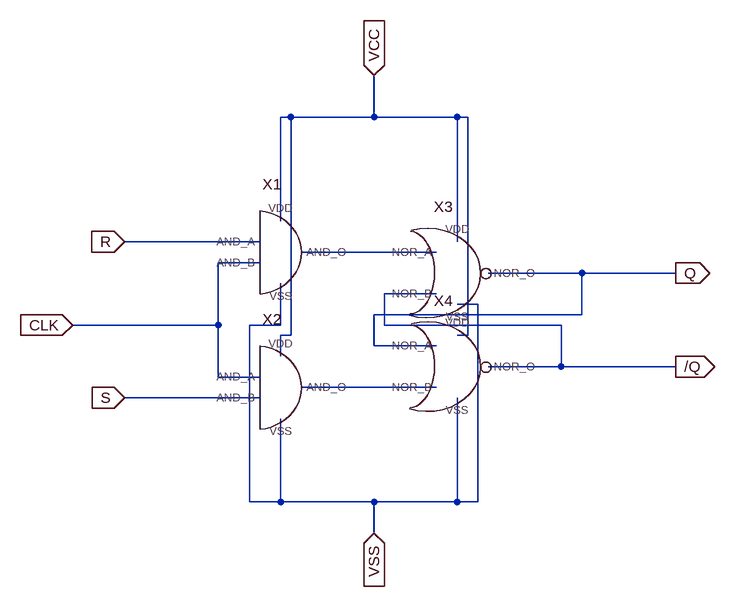
[diagram p0: schematic m_SR_ff.asc]
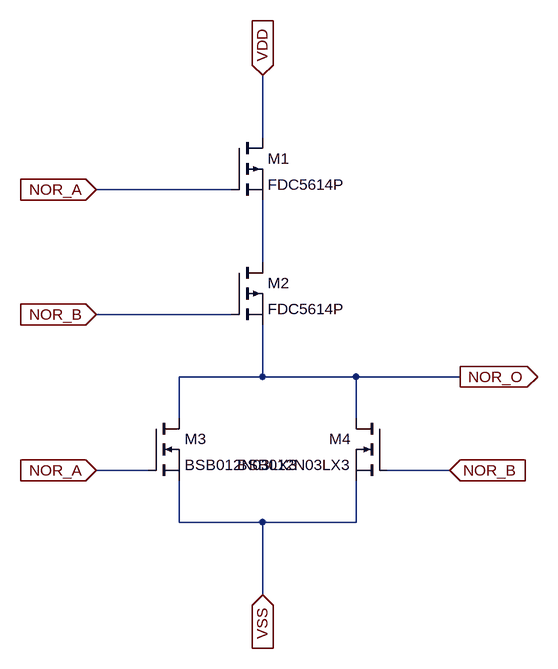
[diagram p1: sub-circuit m_nor.asc]
m_SR_ff.asc, the LTspice schematic file:
Version 4
SHEET 1 1004 680
WIRE 320 -96 304 -96
WIRE 448 -96 448 -160
WIRE 448 -96 320 -96
WIRE 576 -96 448 -96
WIRE 592 -96 576 -96
WIRE 304 64 304 -96
WIRE 272 96 64 96
WIRE 576 96 576 -96
WIRE 544 112 336 112
WIRE 272 128 208 128
WIRE 768 144 624 144
WIRE 912 144 768 144
WIRE 544 176 464 176
WIRE 608 192 576 192
WIRE 768 208 768 144
WIRE 768 208 448 208
WIRE 208 224 208 128
WIRE 208 224 -16 224
WIRE 304 224 304 160
WIRE 304 224 256 224
WIRE 464 224 464 176
WIRE 736 224 464 224
WIRE 320 240 320 -96
WIRE 320 240 304 240
WIRE 592 240 592 -96
WIRE 592 240 576 240
WIRE 448 256 448 208
WIRE 544 256 448 256
WIRE 304 272 304 240
WIRE 736 288 736 224
WIRE 736 288 624 288
WIRE 912 288 736 288
WIRE 208 304 208 224
WIRE 272 304 208 304
WIRE 544 320 336 320
WIRE 272 336 64 336
WIRE 256 496 256 224
WIRE 304 496 304 368
WIRE 304 496 256 496
WIRE 448 496 304 496
WIRE 576 496 576 336
WIRE 576 496 448 496
WIRE 608 496 608 192
WIRE 608 496 576 496
WIRE 448 544 448 496
FLAG -16 224 CLK
IOPIN -16 224 In
FLAG 912 144 Q
IOPIN 912 144 Out
FLAG 912 288 /Q
IOPIN 912 288 Out
FLAG 64 96 R
IOPIN 64 96 In
FLAG 64 336 S
IOPIN 64 336 In
FLAG 448 -160 VCC
IOPIN 448 -160 In
FLAG 448 544 VSS
IOPIN 448 544 In
SYMBOL m_And 336 112 R0
SYMATTR InstName X1
SYMBOL m_And 336 320 R0
SYMATTR InstName X2
SYMBOL m_Nor 624 144 R0
SYMATTR InstName X3
SYMBOL m_Nor 624 288 R0
SYMATTR InstName X4

m_nor.asc, the sub-circuit schematic file:
Version 4
SHEET 1 880 680
WIRE 144 -224 144 -320
WIRE 96 -144 -112 -144
WIRE 144 -32 144 -128
WIRE 96 48 -112 48
WIRE 144 144 144 64
WIRE 144 144 16 144
WIRE 288 144 144 144
WIRE 448 144 288 144
WIRE 16 208 16 144
WIRE 288 208 288 144
WIRE -32 288 -112 288
WIRE 432 288 336 288
WIRE 16 368 16 304
WIRE 144 368 16 368
WIRE 288 368 288 304
WIRE 288 368 144 368
WIRE 144 480 144 368
FLAG 144 480 VSS
IOPIN 144 480 In
FLAG 144 -320 VDD
IOPIN 144 -320 In
FLAG 448 144 NOR_O
IOPIN 448 144 Out
FLAG -112 288 NOR_A
IOPIN -112 288 In
FLAG -112 -144 NOR_A
IOPIN -112 -144 In
FLAG -112 48 NOR_B
IOPIN -112 48 In
FLAG 432 288 NOR_B
IOPIN 432 288 In
SYMBOL pmos 96 -224 R0
SYMATTR InstName M1
SYMATTR Value FDC5614P
SYMBOL pmos 96 -32 R0
SYMATTR InstName M2
SYMATTR Value FDC5614P
SYMBOL nmos -32 208 R0
SYMATTR InstName M3
SYMATTR Value BSB012N03LX3
SYMBOL nmos 336 208 M0
SYMATTR InstName M4
SYMATTR Value BSB012N03LX3

The netlist it stands for:
* m_SR_ff.asc
XX1 R CLK VCC VSS N001 m_And  ; pins AND_A AND_B VDD VSS AND_O
XX2 CLK S VCC VSS N002 m_And  ; pins AND_A AND_B VDD VSS AND_O
XX3 N001 /Q VCC VSS Q m_nor
XX4 Q N002 VCC VSS /Q m_nor

* block symbol definitions
.subckt m_nor NOR_A NOR_B VDD VSS NOR_O
M1 VDD NOR_A N001 N001 FDC5614P
M2 N001 NOR_B NOR_O NOR_O FDC5614P
M3 NOR_O NOR_A VSS VSS BSB012N03LX3
M4 NOR_O NOR_B VSS VSS BSB012N03LX3
.ends m_nor

.model NMOS NMOS
.model PMOS PMOS
.lib standard.mos
.backanno
.end